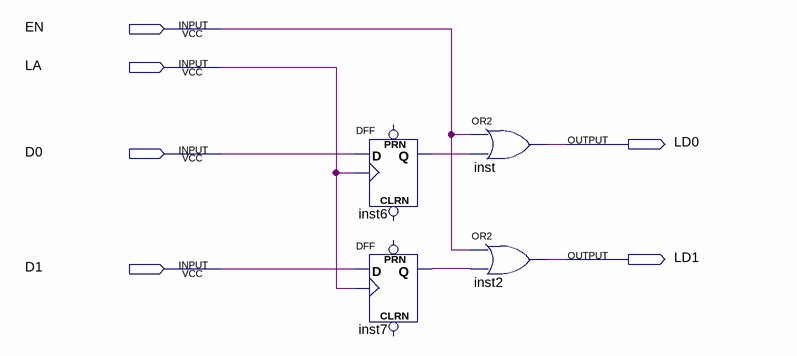
[diagram p0: schematic sheet]
// Quartus schematic 2latchedge0.bdf as structural Verilog: 4 symbols, 6 pins
module \2latchedge0  (
  input  EN,
  input  LA,
  input  D0,
  input  D1,
  output LD0,
  output LD1
);

  wire inst6_q, inst7_q;

  DFF inst6 (.CLK(LA), .D(D0), .Q(inst6_q));  // open: CLRN, PRN
  DFF inst7 (.CLK(LA), .D(D1), .Q(inst7_q));  // open: CLRN, PRN
  or inst (LD0, EN, inst6_q);
  or inst2 (LD1, EN, inst7_q);
endmodule
